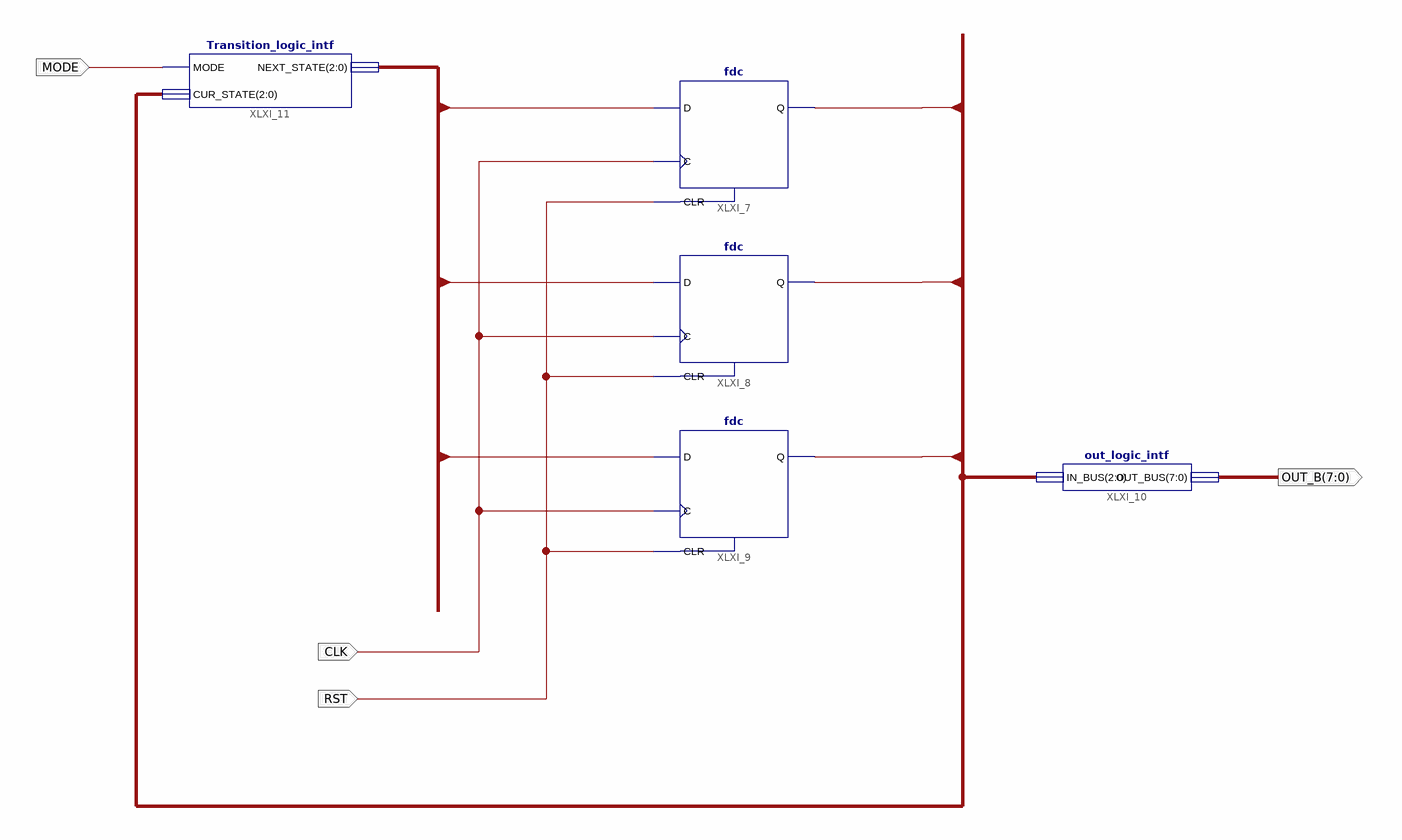
[diagram p0: schematic sheet 1]
// Xilinx ISE schematic LightController.sch (spartan3a) as structural Verilog: 5 symbols, 4 ports
module LightController (
  input  MODE,
  input  CLK,
  input  RST,
  output [7:0] OUT_B
);

  wire [2:0] CUR_S_BUS, NS_BUS;

  fdc XLXI_7 (.C(CLK), .CLR(RST), .D(NS_BUS[2]), .Q(CUR_S_BUS[2]));
  fdc XLXI_8 (.C(CLK), .CLR(RST), .D(NS_BUS[1]), .Q(CUR_S_BUS[1]));
  fdc XLXI_9 (.C(CLK), .CLR(RST), .D(NS_BUS[0]), .Q(CUR_S_BUS[0]));
  out_logic_intf XLXI_10 (.IN_BUS(CUR_S_BUS), .OUT_BUS(OUT_B));
  Transition_logic_intf XLXI_11 (.MODE(MODE), .CUR_STATE(CUR_S_BUS), .NEXT_STATE(NS_BUS));
endmodule
